# Altium schematic sheet Fixture_07.SchDoc
size A4; SheetNumber: 9; SheetTotal: 9
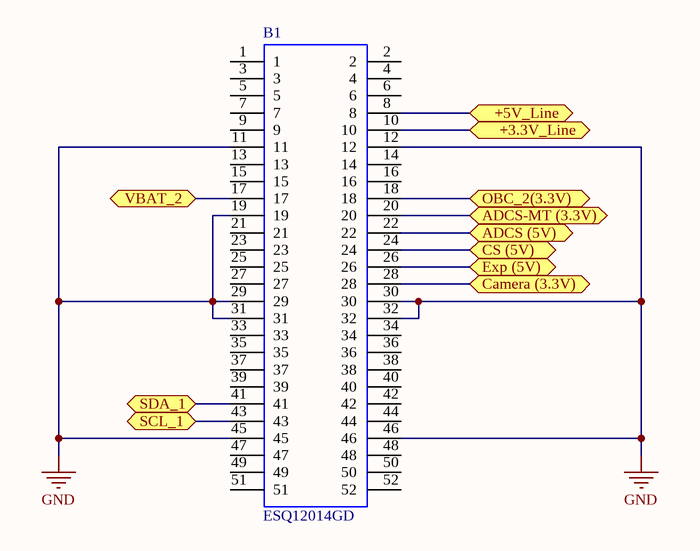
[diagram p0: Fixture_07.SchDoc]

## Parts
B1  ESQ12014GD  [PinHeader104]

## Ports
+3.3V_Line, +5V_Line, ADCS (5V), ADCS-MT (3.3V), Camera (3.3V), CS (5V), Exp (5V), OBC_2(3.3V), SCL_1, SDA_1, VBAT_2

## Nets
GND: B1.11 B1.12 B1.19 B1.29 B1.30 B1.31 B1.32 B1.45 B1.46
+3.3V_Line: B1.10 ; port +3.3V_Line
+5V_Line: B1.8 ; port +5V_Line
ADCS (5V): B1.22 ; port ADCS (5V)
ADCS-MT (3.3V): B1.20 ; port ADCS-MT (3.3V)
Camera (3.3V): B1.28 ; port Camera (3.3V)
CS (5V): B1.24 ; port CS (5V)
Exp (5V): B1.26 ; port Exp (5V)
OBC_2(3.3V): B1.18 ; port OBC_2(3.3V)
SCL_1: B1.43 ; port SCL_1
SDA_1: B1.41 ; port SDA_1
VBAT_2: B1.17 ; port VBAT_2

Not connected (* = marked no-connect by the designer): B1 1 2 3 4 5 6 7 9 13 14 15 16 21 23 25 27 33 34 35 36 37 38 39 40 42 44 47 48 49 50 51 52

## Library data of the parts
B1 = ESQ12014GD: 2x20 way standard long pin PCB socket Samtec ESQ Series 2.54mm 40 Way 2 Row Straight PCB Socket Through Hole Board to Board; Supplier_Name: RS; RS Part Number: 2546110; Manufacturer_Name: SAMTEC; Manufacturer_Part_Number: ESQ12014GD; Datasheet Link: http://docs-europe.electrocomponents.com/webdocs/1420/0900766b814207fc.pdf; Height: 11.05mm; Allied_Number: *; 3D Package: *; Other Part Number: *